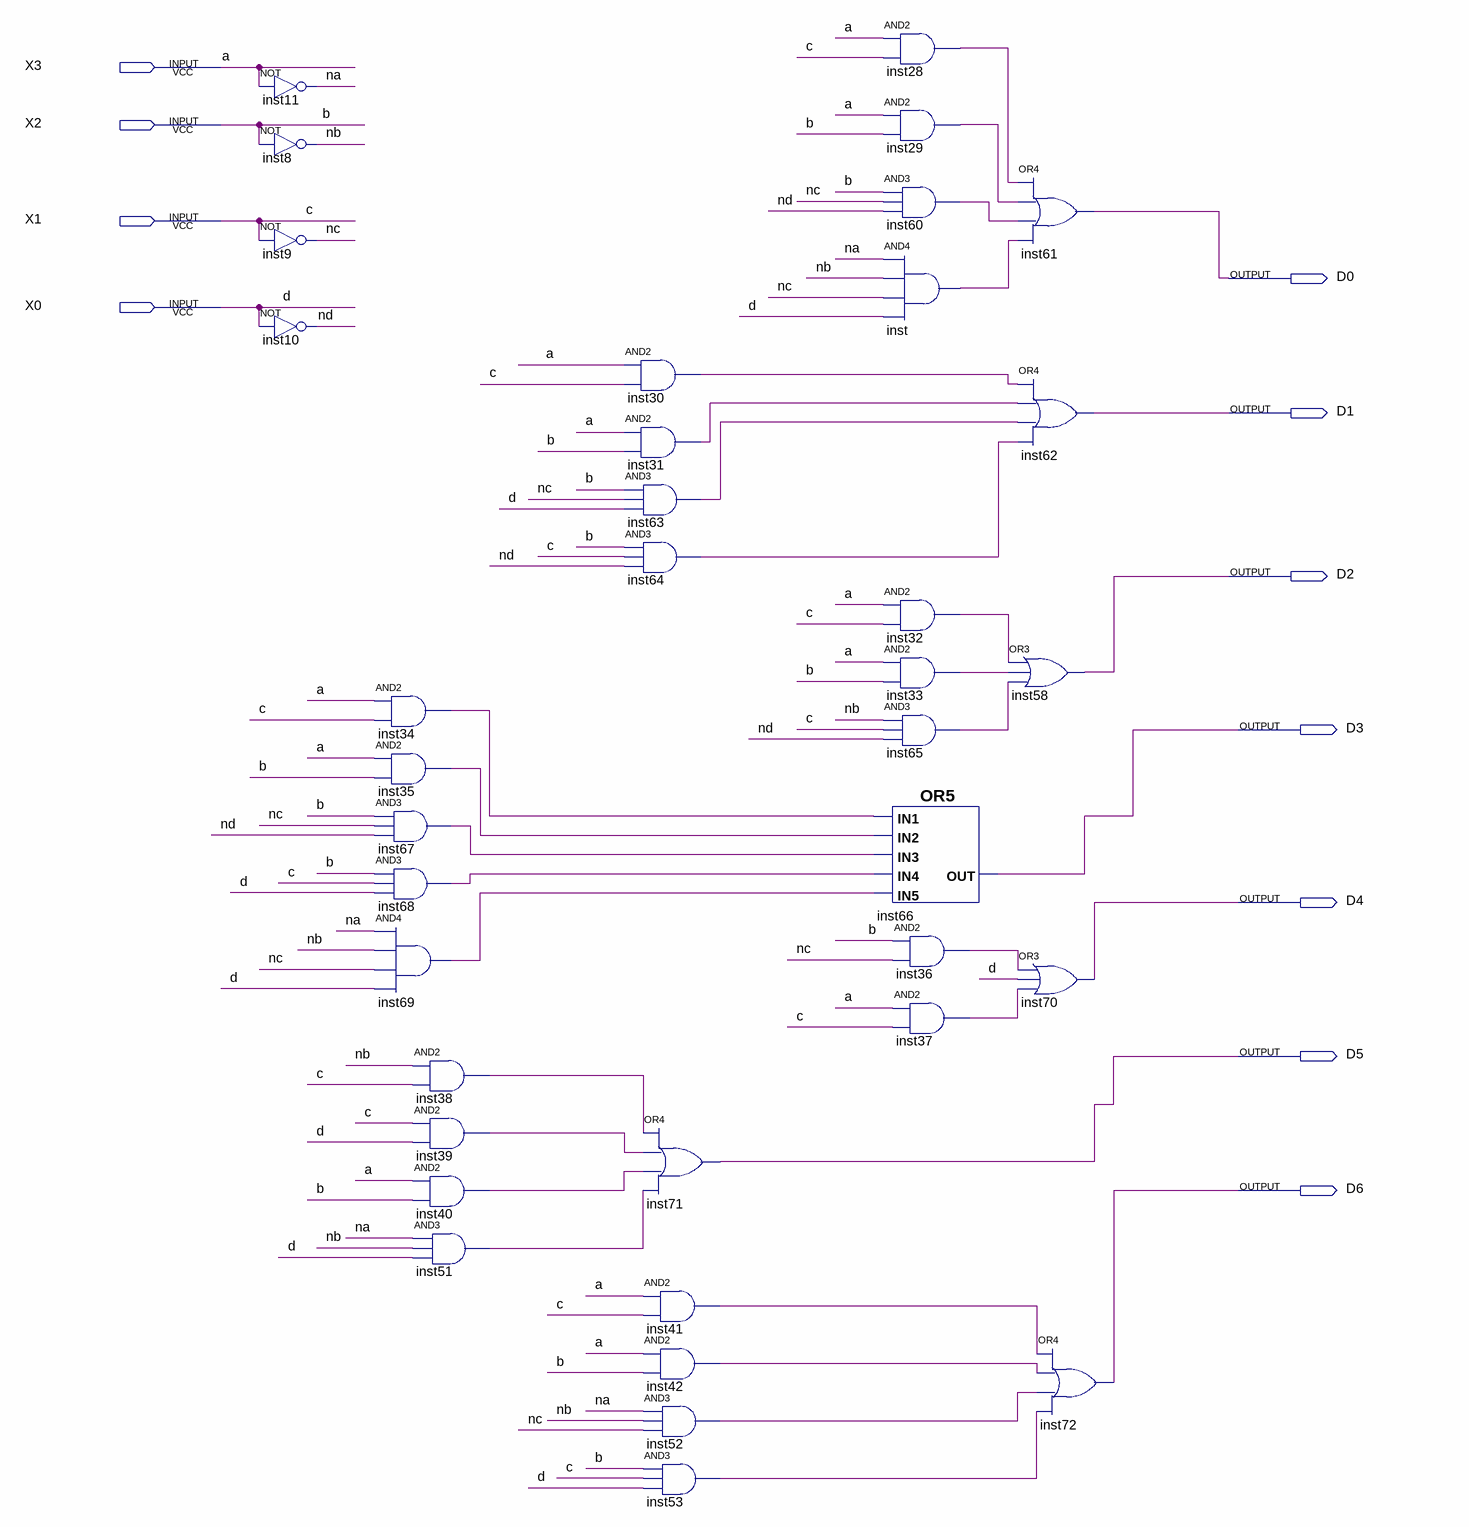
[diagram p0: schematic sheet]
// Quartus schematic SeteSeg.bdf as structural Verilog: 37 symbols, 11 pins
module SeteSeg (
  input  X3,
  input  X2,
  input  X1,
  input  X0,
  output D0,
  output D1,
  output D2,
  output D3,
  output D4,
  output D5,
  output D6
);

  wire inst28_out, inst29_out, inst30_out, inst31_out, inst32_out, inst33_out, inst34_out, inst35_out,
       inst36_out, inst37_out, inst38_out, inst39_out, inst40_out, inst41_out, inst42_out, inst51_out,
       inst52_out, inst53_out, inst60_out, inst63_out, inst64_out, inst65_out, inst67_out, inst68_out,
       inst69_out, inst_out, na, nb, nc, nd;

  not inst11 (na, X3);
  not inst8 (nb, X2);
  not inst9 (nc, X1);
  not inst10 (nd, X0);
  and inst34 (inst34_out, X3, X1);
  and inst35 (inst35_out, X3, X2);
  and inst67 (inst67_out, X2, nc, nd);
  and inst68 (inst68_out, X2, X1, X0);
  and inst69 (inst69_out, na, nb, nc, X0);
  and inst38 (inst38_out, nb, X1);
  and inst39 (inst39_out, X1, X0);
  and inst40 (inst40_out, X3, X2);
  and inst51 (inst51_out, na, nb, X0);
  and inst30 (inst30_out, X3, X1);
  and inst31 (inst31_out, X3, X2);
  and inst63 (inst63_out, X2, nc, X0);
  and inst64 (inst64_out, X2, X1, nd);
  or inst71 (D5, inst38_out, inst39_out, inst40_out, inst51_out);
  and inst41 (inst41_out, X3, X1);
  and inst42 (inst42_out, X3, X2);
  and inst52 (inst52_out, na, nb, nc);
  and inst53 (inst53_out, X2, X1, X0);
  and inst28 (inst28_out, X3, X1);
  and inst29 (inst29_out, X3, X2);
  and inst60 (inst60_out, X2, nc, nd);
  and inst (inst_out, na, nb, nc, X0);
  and inst32 (inst32_out, X3, X1);
  and inst33 (inst33_out, X3, X2);
  and inst65 (inst65_out, nb, X1, nd);
  or inst66 (D3, inst34_out, inst35_out, inst67_out, inst68_out, inst69_out);
  and inst36 (inst36_out, X2, nc);
  and inst37 (inst37_out, X3, X1);
  or inst61 (D0, inst28_out, inst29_out, inst60_out, inst_out);
  or inst62 (D1, inst30_out, inst31_out, inst63_out, inst64_out);
  or inst58 (D2, inst32_out, inst33_out, inst65_out);
  or inst70 (D4, inst36_out, X0, inst37_out);
  or inst72 (D6, inst41_out, inst42_out, inst52_out, inst53_out);

  // Other names for the same wires on the sheet: a = X3; b = X2; d = X0; c = X1
endmodule
